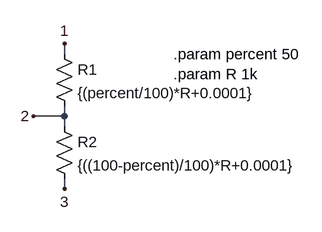
[diagram p0: schematic potentionmeter.asc]
potentionmeter.asc, the LTspice schematic file:
Version 4
SHEET 1 1824 680
WIRE 240 -416 240 -432
WIRE 240 -320 240 -336
WIRE 240 -320 192 -320
WIRE 240 -304 240 -320
WIRE 240 -208 240 -224
FLAG 240 -432 1
FLAG 192 -320 2
FLAG 240 -208 3
SYMBOL res 224 -432 R0
SYMATTR InstName R1
SYMATTR Value {(percent/100)*R+0.0001}
SYMBOL res 224 -320 R0
SYMATTR InstName R2
SYMATTR Value {((100-percent)/100)*R+0.0001}
TEXT 408 -416 Left 2 !.param percent 50\n.param R 1k

The netlist it stands for:
* potentionmeter.asc
R1 1 2 {(percent/100)*R+0.0001}
R2 2 3 {((100-percent)/100)*R+0.0001}
.param percent 50
.param R 1k
.backanno
.end